# EAGLE design dustymaybrusty (EAGLE 9.2.2)
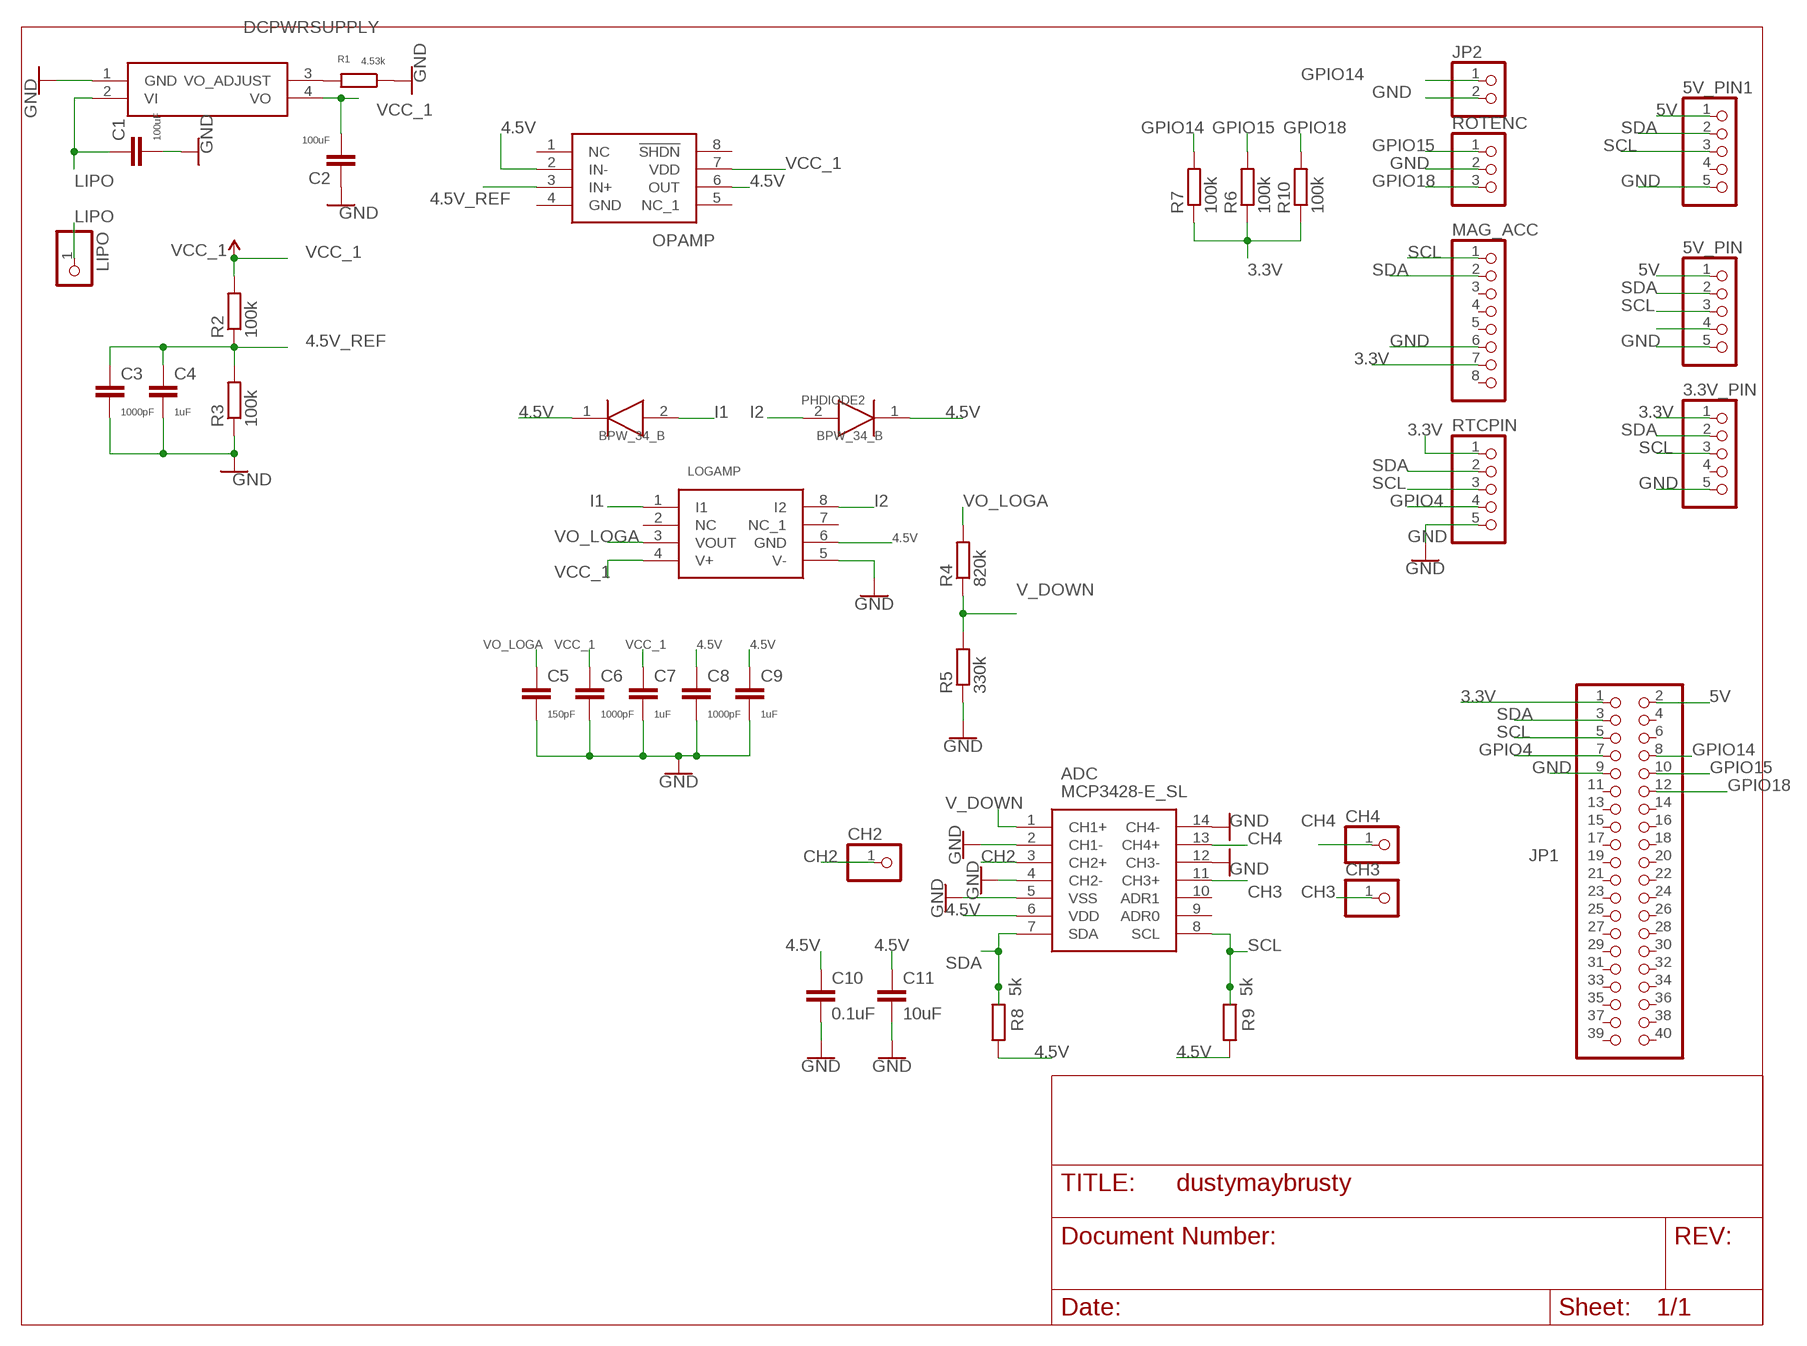
[diagram p0: schematic, sheet 1]

## Parts
3.3V_PIN  PINHD-1X5  [1X05]
5V_PIN  PINHD-1X5  [1X05]
5V_PIN1  PINHD-1X5  [1X05]
ADC  MCP3428-E_SL  [SOIC127P600X175-14N]
C1  100uF  C-EUC1206  [C1206]
C2  100uF  C-EUC1206  [C1206]
C3  1000pF  C-EUC1206  [C1206]
C4  1uF  C-EUC1206  [C1206]
C5  150pF  C-EUC1206  [C1206]
C6  1000pF  C-EUC1206  [C1206]
C7  1uF  C-EUC1206  [C1206]
C8  1000pF  C-EUC1206  [C1206]
C9  1uF  C-EUC1206  [C1206]
C10  0.1uF  C-EUC1206  [C1206]
C11  10uF  C-EUC1206  [C1206]
CH2  PINHD-1X1  [1X01]
CH3  PINHD-1X1  [1X01]
CH4  PINHD-1X1  [1X01]
DCPWRSUPPLY  PTN04050CAD  [EUU(R-PDSS-T4)]
JP1  PINHD-2X20  [2X20]
JP2  PINHD-1X2  [1X02]
LIPO  PINHD-1X1  [1X01]
LOGAMP  LOG104AID  [SOIC127P600X175-8N]
MAG_ACC  PINHD-1X8  [1X08]
OPAMP  TLV2370IP  [DIP794W53P254L959H508Q8N]
PHDIODE1  BPW_34_B  [BPW34B]
PHDIODE2  BPW_34_B  [BPW34B]
R1  4.53k  R-EU_R1206  [R1206]
R2  100k  R-EU_R1206  [R1206]
R3  100k  R-EU_R1206  [R1206]
R4  820k  R-EU_R1206  [R1206]
R5  330k  R-EU_R1206  [R1206]
R6  100k  R-EU_R1206  [R1206]
R7  100k  R-EU_R1206  [R1206]
R8  5k  R-EU_R1206  [R1206]
R9  5k  R-EU_R1206  [R1206]
R10  100k  R-EU_R1206  [R1206]
ROTENC  PINHD-1X3  [1X03]
RTCPIN  PINHD-1X5  [1X05]

## Nets
3.3V: 3.3V_PIN.1 JP1.1 MAG_ACC.7 R6.1 R7.1 R10.1 RTCPIN.1
4.5V: ADC.6(VDD) C8.1 C9.1 C10.1 C11.1 LOGAMP.6(GND) OPAMP.2(IN-) OPAMP.6(OUT) PHDIODE1.1(K) PHDIODE2.1(K) R8.1 R9.1
4.5V_REF: C3.1 C4.1 OPAMP.3(IN+) R2.1 R3.2
5V: 5V_PIN1.1 5V_PIN.1 JP1.2
CH2: ADC.3(CH2+) CH2.1
CH3: ADC.11(CH3+) CH3.1
CH4: ADC.13(CH4+) CH4.1
GND: 3.3V_PIN.5 5V_PIN1.5 5V_PIN.5 ADC.2(CH1-) ADC.4(CH2-) ADC.5(VSS) ADC.12(CH3-) ADC.14(CH4-) C1.2 C2.1 C3.2 C4.2 C5.2 C6.2 C7.2 C8.2 C9.2 C10.2 C11.2 DCPWRSUPPLY.1(GND) JP1.9 JP2.2 LOGAMP.5(V-) MAG_ACC.6 R1.1 R3.1 R5.1 ROTENC.2 RTCPIN.5
GPIO4: JP1.7 RTCPIN.4
GPIO14: JP1.8 JP2.1 R7.2
GPIO15: JP1.10 R6.2 ROTENC.1
GPIO18: JP1.12 R10.2 ROTENC.3
I1: LOGAMP.1(I1) PHDIODE1.2(A)
I2: LOGAMP.8(I2) PHDIODE2.2(A)
LIPO: C1.1 DCPWRSUPPLY.2(VI) LIPO.1
N$2: DCPWRSUPPLY.3(VO_ADJUST) R1.2
N$4: 5V_PIN.4
SCL: 3.3V_PIN.3 5V_PIN1.3 5V_PIN.3 ADC.8(SCL) JP1.5 MAG_ACC.1 R9.2 RTCPIN.3
SDA: 3.3V_PIN.2 5V_PIN1.2 5V_PIN.2 ADC.7(SDA) JP1.3 MAG_ACC.2 R8.2 RTCPIN.2
V_DOWN: ADC.1(CH1+) R4.1 R5.2
VCC_1: C2.2 C6.1 C7.1 DCPWRSUPPLY.4(VO) LOGAMP.4(V+) OPAMP.7(VDD) R2.2
VO_LOGA: C5.1 LOGAMP.3(VOUT) R4.2
Unconnected: 3.3V_PIN.4 5V_PIN1.4 ADC.9(ADR0) ADC.10(ADR1) JP1.4 JP1.6 JP1.11 JP1.13 JP1.14 JP1.15 JP1.16 JP1.17 JP1.18 JP1.19 JP1.20 JP1.21 JP1.22 JP1.23 JP1.24 JP1.25 JP1.26 JP1.27 JP1.28 JP1.29 JP1.30 JP1.31 JP1.32 JP1.33 JP1.34 JP1.35 JP1.36 JP1.37 JP1.38 JP1.39 JP1.40 LOGAMP.2(NC) LOGAMP.7(NC_1) MAG_ACC.3 MAG_ACC.4 MAG_ACC.5 MAG_ACC.8 OPAMP.1(NC) OPAMP.5(NC_1) OPAMP.8(!SHDN)

## Power pins joined to a net without a drawn wire
GND: OPAMP.4(GND)

## Library data of the parts
3.3V_PIN 5V_PIN 5V_PIN1 RTCPIN = pinhead:PINHD-1X5: PIN HEADER
ADC = SamacSys_Parts:MCP3428-E_SL: 16-bit delta-sigma ADC, quad channel Source: Datasheet <https://componentsearchengine.com/Datasheets/1/MCP3428-E_SL.pdf>; DESCRIPTION: 16-bit delta-sigma ADC, quad channel; HEIGHT: 1.75mm; MANUFACTURER_NAME: Microchip; MANUFACTURER_PART_NUMBER: MCP3428-E/SL; MOUSER_PART_NUMBER: 579-MCP3428E/SL
C1-C11 = rcl:C-EU: CAPACITOR, European symbol; SPICEPREFIX: C
CH2-CH4 LIPO = pinhead:PINHD-1X1: PIN HEADER
DCPWRSUPPLY = SamacSys_Parts:PTN04050CAD: Texas Instruments PTN04050CAD, DC-DC Power Supply Module 2.4A 5.5 V Input, 600 kHz, 4-Pin, DIP Module Source: Datasheet <http://www.ti.com/lit/gpn/ptn04050c>; DESCRIPTION: Texas Instruments PTN04050CAD, DC-DC Power Supply Module 2.4A 5.5 V Input, 600 kHz, 4-Pin, DIP Module; HEIGHT: mm; MANUFACTURER_NAME: Texas Instruments; MANUFACTURER_PART_NUMBER: PTN04050CAD; MOUSER_PART_NUMBER: 595-PTN04050CAD
JP1 = pinhead:PINHD-2X20: PIN HEADER
JP2 = pinhead:PINHD-1X2: PIN HEADER
LOGAMP = SamacSys_Parts:LOG104AID: LOG104AID, Logarithmic Amplifier, 8-Pin SOIC Source: Datasheet <http://www.ti.com/general/docs/suppproductinfo.tsp?distId=26&gotoUrl=http://www.ti.com/lit/gpn/log104>; DESCRIPTION: LOG104AID, Logarithmic Amplifier, 8-Pin SOIC; HEIGHT: 1.75mm; MANUFACTURER_NAME: Texas Instruments; MANUFACTURER_PART_NUMBER: LOG104AID; MOUSER_PART_NUMBER: 595-LOG104AID
MAG_ACC = pinhead:PINHD-1X8: PIN HEADER
OPAMP = SamacSys_Parts:TLV2370IP: TLV2370IP, Operational Amplifier 3MHz Rail-Rail 3 to 15V, 8-Pin PDIP Source: Datasheet; DESCRIPTION: TLV2370IP, Operational Amplifier 3MHz Rail-Rail 3 to 15V, 8-Pin PDIP; HEIGHT: 5.08mm; MANUFACTURER_NAME: Texas Instruments; MANUFACTURER_PART_NUMBER: TLV2370IP; MOUSER_PART_NUMBER: 595-TLV2370IP
PHDIODE1 PHDIODE2 = SamacSys_Parts:BPW_34_B: Photodiodes PHOTODIODE T/H Source: Datasheet <https://media.osram.info/media/resource/hires/osram-dam-2495824/BPW 34 B.pdf>; DESCRIPTION: Photodiodes PHOTODIODE T/H; HEIGHT: 2.2mm; MANUFACTURER_NAME: Osram Opto Semiconductor; MANUFACTURER_PART_NUMBER: BPW 34 B; MOUSER_PART_NUMBER: 720-BPW34B
R1-R10 = rcl:R-EU_: RESISTOR, European symbol; SPICEPREFIX: R
ROTENC = pinhead:PINHD-1X3: PIN HEADER

## Board
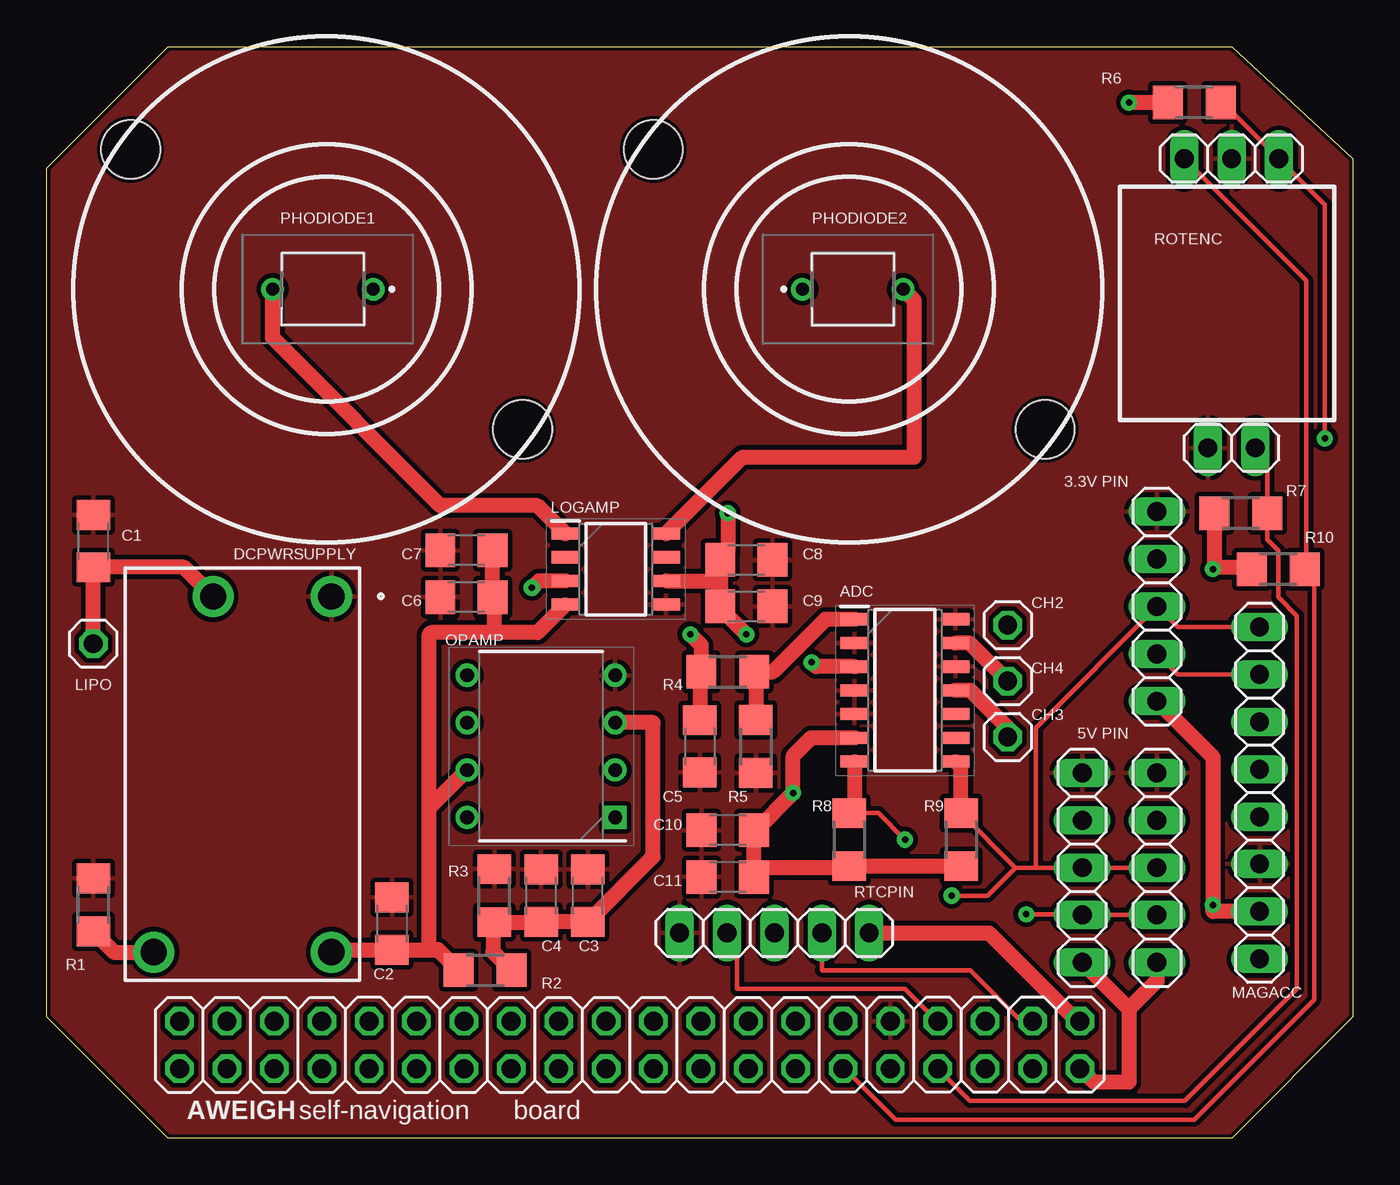
[diagram p1: board, top side]
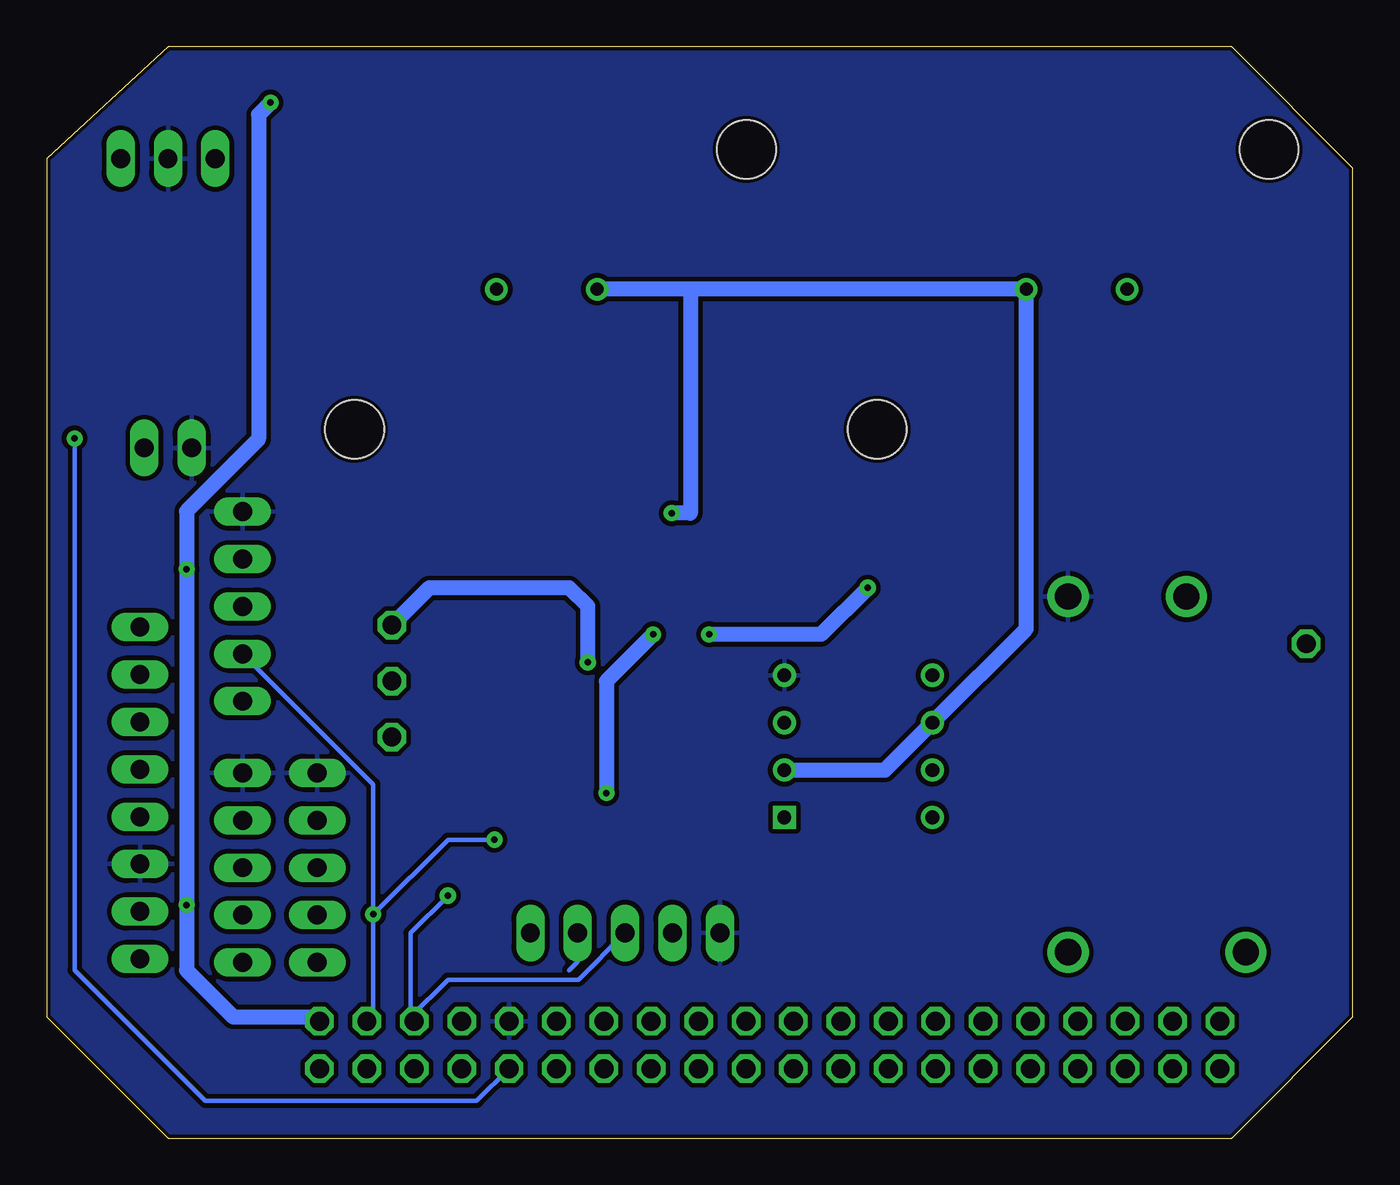
[diagram p2: board, bottom side, seen from below]

Size 70 x 58.5 mm. Coordinates in mm from the lower left corner, seen from the top.
Outline: 0,6.5 0,52 6.5,58.5 63.5,58.5 70,52.5 70,6.5 63.5,0 6.5,0 0,6.5
Copper layers (1*16): Top 0.035mm / dielectric 1.5mm / Bottom 0.035mm
Design rules "SparkFun-2-layer-STANDARD": minimum track width 10mil, minimum drill 20mil, track to track 10mil, track to pad 8mil, pad to pad 8mil, via to via 10mil, smd to smd 8mil, copper to edge 8mil, drill to drill 8mil, minimum pad ring 10mil, minimum via ring 10mil, stop-mask expansion 4mil, vias tented up to drill 25mil, thermal gap 10mil
Holes 3.15 mm at 53.5,38 32.5,53 25.5,38 4.5,53

### Footprints (pad centres in the part's own frame; a part is rotated, then mirrored left to right if it is on the bottom)
1X05 = drill 1.016 long: 1 -5.08,0; 2 -2.54,0; 3 0,0; 4 2.54,0; 5 5.08,0
SOIC127P600X175-14N = smd 1.5 x 0.65: 1 -2.7,3.81; 2 -2.7,2.54; 3 -2.7,1.27; 4 -2.7,0; 5 -2.7,-1.27; 6 -2.7,-2.54; 7 -2.7,-3.81; 8 2.7,-3.81; 9 2.7,-2.54; 10 2.7,-1.27; 11 2.7,0; 12 2.7,1.27; 13 2.7,2.54; 14 2.7,3.81
C1206 = smd 1.6 x 1.8: 1 -1.4,0; 2 1.4,0
1X01 = drill 1.016 octagon: 1 0,0
EUU(R-PDSS-T4) = drill 1.4 pad 2.2: 1 -9.53,4.76; 2 -9.53,-1.58; 3 9.53,-4.76; 4 9.53,4.76
2X20 = drill 1.016 octagon: 1 -24.13,-1.27; 2 -24.13,1.27; 3 -21.59,-1.27; 4 -21.59,1.27; 5 -19.05,-1.27; 6 -19.05,1.27; 7 -16.51,-1.27; 8 -16.51,1.27; 9 -13.97,-1.27; 10 -13.97,1.27; 11 -11.43,-1.27; 12 -11.43,1.27; 13 -8.89,-1.27; 14 -8.89,1.27; 15 -6.35,-1.27; 16 -6.35,1.27; 17 -3.81,-1.27; 18 -3.81,1.27; 19 -1.27,-1.27; 20 -1.27,1.27; 21 1.27,-1.27; 22 1.27,1.27; 23 3.81,-1.27; 24 3.81,1.27; 25 6.35,-1.27; 26 6.35,1.27; 27 8.89,-1.27; 28 8.89,1.27; 29 11.43,-1.27; 30 11.43,1.27; 31 13.97,-1.27; 32 13.97,1.27; 33 16.51,-1.27; 34 16.51,1.27; 35 19.05,-1.27; 36 19.05,1.27; 37 21.59,-1.27; 38 21.59,1.27; 39 24.13,-1.27; 40 24.13,1.27
1X02 = drill 1.016 long: 1 -1.27,0; 2 1.27,0
SOIC127P600X175-8N = smd 1.5 x 0.65: 1 -2.7,1.905; 2 -2.7,0.635; 3 -2.7,-0.635; 4 -2.7,-1.905; 5 2.7,-1.905; 6 2.7,-0.635; 7 2.7,0.635; 8 2.7,1.905
1X08 = drill 1.016 long: 1 -8.89,0; 2 -6.35,0; 3 -3.81,0; 4 -1.27,0; 5 1.27,0; 6 3.81,0; 7 6.35,0; 8 8.89,0
DIP794W53P254L959H508Q8N = drill 0.73 pad 1.13 square: 1 -3.97,3.81 | drill 0.73 pad 1.13: 2 -3.97,1.27; 3 -3.97,-1.27; 4 -3.97,-3.81; 5 3.97,-3.81; 6 3.97,-1.27; 7 3.97,1.27; 8 3.97,3.81
BPW34B = drill 0.7 pad 1.2: 1 0,0; 2 5.4,0
R1206 = smd 1.6 x 1.803: 1 -1.422,0; 2 1.422,0
1X03 = drill 1.016 long: 1 -2.54,0; 2 0,0; 3 2.54,0

### Placement (x,y rotation side)
3.3V_PIN  59.5,28.5 90 top
5V_PIN  55.5,14.5 90 top
5V_PIN1  59.5,14.5 90 top
ADC  46,24 0 top
C1  2.5,32 90 top
C2  18.5,11.5 270 top
C3  29,13 90 top
C4  26.5,13 90 top
C5  35,21 270 top
C6  22.5,29 180 top
C7  22.5,31.5 180 top
C8  37.5,31 0 top
C9  37.5,28.5 0 top
C10  36.5,16.5 180 top
C11  36.5,14 180 top
CH2  51.5,27.5 0 top
CH3  51.5,21.5 0 top
CH4  51.5,24.5 0 top
DCPWRSUPPLY  10.5,19.5 270 top
JP1  31.25,5 180 top
JP2  63.5,37 180 top
LIPO  2.5,26.5 180 top
LOGAMP  30.5,30.5 0 top
MAG_ACC  65,18.5 270 top
OPAMP  26.5,21 180 top
PHDIODE1  17.5,45.5 180 top
PHDIODE2  40.5,45.5 0 top
R1  2.5,12.5 270 top
R2  23.5,9 180 top
R3  24,13 270 top
R4  36.5,25 180 top
R5  38,21 90 top
R6  61.5,55.5 0 top
R7  64,33.5 0 top
R8  43,16 90 top
R9  49,16 90 top
R10  66,30.5 0 top
ROTENC  63.5,52.5 180 top
RTCPIN  39,11 180 top

### Tracks (layer width: path | path; a pad name or v marks a point on that pad's centre or on a via)
3.3V  (via drill 0.35)
  Top 0.8: RTCPIN.1 50.5,11 55.23,6.27 JP1.1 | MAG_ACC.7 62.5,12.15 v62.5,12.5 62.5,20.42 3.3V_PIN.1 | R7.1 62.58,30.58 | 62.58,30.58 v62.5,30.5 | R10.1 64.5,30.58 62.58,30.58 | R6.1 v58,55.5
  Bottom 0.8: JP1.1 55.61,6.5 60,6.5 62.5,9 v62.5,12.5 v62.5,30.5 62.5,33.61 58.65,37.46 58.65,54.85 v58,55.5
4.5V  (via drill 0.35, 0.35 pad 0.6)
  Top 0.8: 36.1,29.5 C8.1 36.5,31.4 v36.5,33.5 | 36.1,29.5 C9.1 36.1,28.4 v37.5,27 | R9.1 R8.1 43.68,14.58 43.6,14.5 38.4,14.5 C11.1 C10.1 38,16.5 v40,18.5 40,20.5 40.96,21.46 ADC.6 | LOGAMP.6 35.73,29.86 36.1,29.5
  Bottom 0.8: OPAMP.2 25.07,19.73 OPAMP.6 17.5,27.3 PHDIODE1.1 35.5,45.5 | 35.5,45.5 PHDIODE2.1 | 35.5,45.5 35.5,33.5 v36.5,33.5 | v37.5,27 40,24.5 v40,18.5
4.5V_REF
  Top 0.8: R2.1 23.92,10 23.92,11.5 R3.2 26.48,11.58 C4.1 C3.1 32.5,15.1 32.5,22.27 OPAMP.3
5V
  Top 0.8: 5V_PIN.1 58,6.92 | 58,6.92 58,3 56.11,3 JP1.2 | 5V_PIN1.1 59.5,8.42 58,6.92
CH2  (via drill 0.35 pad 0.6)
  Top 0.8: ADC.3 41.23,25.27 v41,25.5
  Bottom 0.8: v41,25.5 41,28.5 42,29.5 49.5,29.5 CH2.1
CH3
  Top 0.8: CH3.1 51.5,22 49.5,24 ADC.11
CH4
  Top 0.8: CH4.1 49.46,26.54 ADC.13
GND
  pour Top: -2.5,67 82.5,67 82.5,66 82.5,-2.5 -2.5,-2.5
  pour Bottom: -2,59 -2,-1 66,-1 72,5 72,52.5 65.5,59
GPIO4
  Top 0.254: RTCPIN.4 37,10.46 37,8 46,8 47.73,6.27 JP1.7
GPIO14
  Top 0.254: JP1.8 49.49,2 61,2 67,8 67,28 66,29 66,31.5 65.42,32.08 R7.2 65.42,36.35 JP2.1
GPIO15  (via drill 0.35)
  Top 0.254: v68.5,37.5 68.5,50.04 ROTENC.1 63.04,55.5 R6.2
  Bottom 0.254: v68.5,37.5 68.5,9 61.5,2 46.95,2 JP1.10
GPIO18
  Top 0.254: ROTENC.3 67.5,45.96 67.5,30.58 R10.2 67.92,30 67.92,7.42 61.5,1 45.5,1 42.77,3.73 JP1.12
I1
  Top 0.8: LOGAMP.1 26.3,33.91 21.09,33.91 12.1,42.9 PHDIODE1.2
I2
  Top 0.8: LOGAMP.8 37.3,36.5 46.5,36.5 46.5,44.9 PHDIODE2.2
LIPO
  Top 0.8: DCPWRSUPPLY.2 7.35,30.6 C1.1 LIPO.1
N$2
  Top 0.8: R1.2 3.61,9.97 DCPWRSUPPLY.3
SCL  (via drill 0.35)
  Top 0.254: 50.23,6.27 JP1.5 | 5V_PIN1.3 5V_PIN.3 53,14.5 | R9.2 51.92,14.5 | 51.92,14.5 53,14.5 | 51.92,14.5 50.42,13 v48.5,13 | MAG_ACC.1 60.61,27.39 3.3V_PIN.3 53,22 53,14.5
  Top 0.8: R9.2 49,19.92 48.73,20.19 ADC.8
  Bottom 0.254: v48.5,13 50.5,11 50.5,6.5 | 50.5,6.5 50.5,6.47 JP1.5 | RTCPIN.3 41.51,8.49 42.21,8.49 42.22,8.5 48.5,8.5 50.5,6.5
SDA  (via drill 0.35)
  Top 0.254: RTCPIN.2 41.54,9 49.5,9 52.23,6.27 JP1.3 | 5V_PIN1.2 5V_PIN.2 55.46,12 v52.5,12 | R8.2 44.58,17.42 v46,16 | 3.3V_PIN.2 60.61,24.85 MAG_ACC.2
  Top 0.8: ADC.7 43.3,17.72 R8.2
  Bottom 0.254: v46,16 48.5,16 v52.5,12 | v52.5,12 52.5,6.61 JP1.3 | 3.3V_PIN.2 52.5,18.96 v52.5,12 | RTCPIN.2 41.54,9.46 42,9
V_DOWN
  Top 0.8: ADC.1 41.73,27.81 38.92,25 R4.1 38,24.92 R5.2
VCC_1
  Top 0.8: DCPWRSUPPLY.4 15.39,10.1 C2.2 20.5,10.1 | 20.5,10.1 20.98,10.1 R2.2 | 20.5,10.1 20.5,17.7 | 20.5,17.7 OPAMP.7 | 20.5,17.7 20.5,27 20.59,27.09 24,27.09 | LOGAMP.4 26.3,27.09 24,27.09 | 24,27.09 24,28.9 C6.1 C7.1
VO_LOGA  (via drill 0.35)
  Top 0.8: C5.1 35,24.92 R4.2 35.08,26.42 v34.5,27 | LOGAMP.3 26.36,29.86 v26,29.5
  Bottom 0.8: v26,29.5 28.5,27 v34.5,27

### Text on the board
tPlace: R6 | PHODIODE1 | PHODIODE2 | ROTENC | 3.3V PIN | R7 | LOGAMP | R10 | C1 | DCPWRSUPPLY | C7 | C8 | C6 | C9 | ADC | CH2 | OPAMP | CH4 | LIPO | R4 | CH3 | 5V PIN | C5 | R5 | C10 | R8 | R9 | R3 | C11 | RTCPIN | C4 | C3 | R1 | C2 | R2 | MAGACC | AWEIGH | self-navigation | board